# EAGLE schematic board(diff - locked for some reason) (EAGLE 8.3.1)
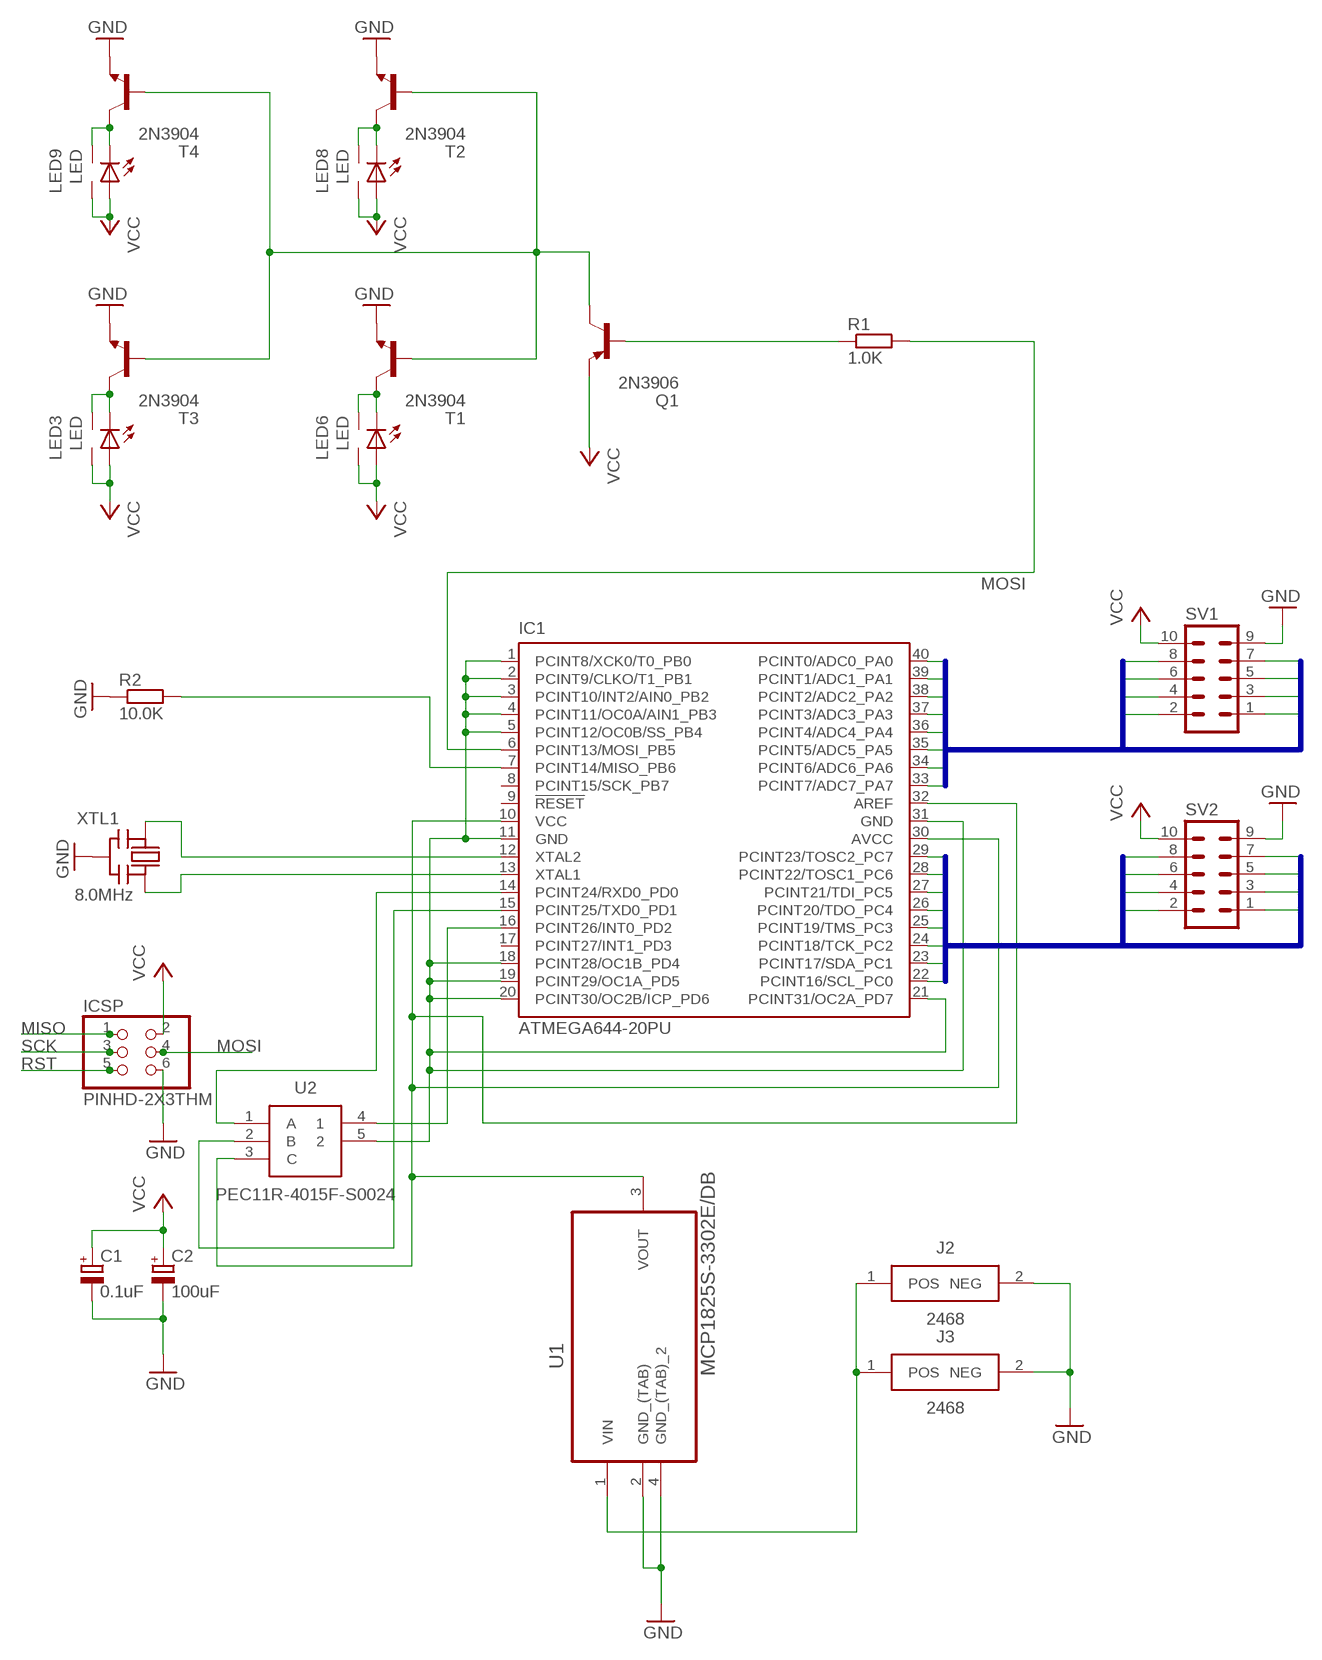
[diagram p0: schematic, sheet 1]

## Parts
C1  0.1uF  CPOL-EUE2,5-6E  [E2,5-6E]
C2  100uF  CPOL-EUE2,5-6E  [E2,5-6E]
IC1  ATMEGA644-20PU  [DIL40]
ICSP  PINHD-2X3THM  [ISP6]
J2  2468  [2468]
J3  2468  [2468]
LED3  LED  [5MM-SIDE]
LED6  LED  [5MM-SIDE]
LED8  LED  [5MM-SIDE]
LED9  LED  [5MM-SIDE]
Q1  2N3906  [TO92]
R1  1.0K  R-EU_0207/7  [0207/7]
R2  10.0K  R-EU_0207/7  [0207/7]
SV1  MA05-2  [MA05-2]
SV2  MA05-2  [MA05-2]
T1  2N3904  [TO92]
T2  2N3904  [TO92]
T3  2N3904  [TO92]
T4  2N3904  [TO92]
U1  MCP1825S-3302E/DB  [SOT230P700X180-4N]
U2  PEC11R-4015F-S0024  [PEC12R-4XXXF-SXXXX_1]
XTL1  8.0MHz  CERMOSCILL  [CERM_OSC]

## Nets
GND: C1.- C2.- ICSP.6 J2.2(NEG) J3.2(NEG) R2.1 SV1.9 SV2.9 T1.3(E) T2.3(E) T3.3(E) T4.3(E) U1.2(GND_(TAB)) U1.4(GND_(TAB)_2) XTL1.P$2(GND)
MISO: ICSP.1
MOSI: IC1.6(PCINT13/MOSI_PB5) ICSP.4 R1.2
N$1: LED6.K2(C1) LED6.K(C) T1.1(C)
N$2: LED3.K2(C1) LED3.K(C) T3.1(C)
N$3: LED8.K2(C1) LED8.K(C) T2.1(C)
N$4: LED9.K2(C1) LED9.K(C) T4.1(C)
N$5: Q1.1(C) T1.2(B) T2.2(B) T3.2(B) T4.2(B)
N$6: IC1.14(PCINT24/RXD0_PD0) U2.1(A)
N$7: IC1.15(PCINT25/TXD0_PD1) U2.2(B)
N$8: IC1.10(VCC) IC1.30(AVCC) IC1.32(AREF) U1.3(VOUT) U2.3(C)
N$9: IC1.12(XTAL2) XTL1.P$1(IN)
N$10: IC1.13(XTAL1) XTL1.P$3(OUT)
N$11: IC1.7(PCINT14/MISO_PB6) R2.2
N$13: IC1.16(PCINT26/INT0_PD2) U2.4
N$16: J2.1(POS) J3.1(POS) U1.1(VIN)
N$21: IC1.1(PCINT8/XCK0/T0_PB0) IC1.2(PCINT9/CLKO/T1_PB1) IC1.3(PCINT10/INT2/AIN0_PB2) IC1.4(PCINT11/OC0A/AIN1_PB3) IC1.5(PCINT12/OC0B/SS_PB4) IC1.11(GND) IC1.18(PCINT28/OC1B_PD4) IC1.19(PCINT29/OC1A_PD5) IC1.20(PCINT30/OC2B/ICP_PD6) IC1.21(PCINT31/OC2A_PD7) IC1.31(GND) U2.5
N$22: Q1.2(B) R1.1
PA0: IC1.40(PCINT0/ADC0_PA0) SV1.8
PA1: IC1.39(PCINT1/ADC1_PA1) SV1.6
PA2: IC1.38(PCINT2/ADC2_PA2) SV1.4
PA3: IC1.37(PCINT3/ADC3_PA3) SV1.2
PA4: IC1.36(PCINT4/ADC4_PA4) SV1.1
PA5: IC1.35(PCINT5/ADC5_PA5) SV1.3
PA6: IC1.34(PCINT6/ADC6_PA6) SV1.5
PA7: IC1.33(PCINT7/ADC7_PA7) SV1.7
PC0: IC1.22(PCINT16/SCL_PC0) SV2.8
PC1: IC1.23(PCINT17/SDA_PC1) SV2.6
PC2: IC1.24(PCINT18/TCK_PC2) SV2.4
PC3: IC1.25(PCINT19/TMS_PC3) SV2.2
PC4: IC1.26(PCINT20/TDO_PC4) SV2.1
PC5: IC1.27(PCINT21/TDI_PC5) SV2.3
PC6: IC1.28(PCINT22/TOSC1_PC6) SV2.5
PC7: IC1.29(PCINT23/TOSC2_PC7) SV2.7
RST: ICSP.5
SCK: ICSP.3
VCC: C1.+ C2.+ ICSP.2 LED3.A LED3.A2(A1) LED6.A LED6.A2(A1) LED8.A LED8.A2(A1) LED9.A LED9.A2(A1) Q1.3(E) SV1.10 SV2.10
Unconnected: IC1.8(PCINT15/SCK_PB7) IC1.9(!RESET) IC1.17(PCINT27/INT1_PD3)

## Buses
PA[0..7]
PC[0..7]

## Library data of the parts
C1 C2 = rcl:CPOL-EU: POLARIZED CAPACITOR, European symbol
IC1 = atmel:ATMEGA644-*PU: 8-bit Microcontroller with 64K Bytes In-System Programmable Flash Auto generated by make-symbol-device-package-bsdl.ulp Rev. 34 Source: http://www.atmel.com/dyn/resources/prod_documents/doc2593.pdf; MPN: ATMEGA644-20PU; OC_FARNELL: 1288340; OC_NEWARK: 23M5060
ICSP = adaprog:PINHD-2X3
J2 J3 = SamacSys_Parts:2468: Cylindrical Battery Contacts, Clips, Holders & Springs 2AAA PC MNT HOLDER <https://componentsearchengine.com/Images/1/2468.jpg> Source: Datasheet <http://docs-europe.electrocomponents.com/webdocs/002e/0900766b8002ef75.pdf>; ALLIED_NUMBER: 70182756; DESCRIPTION: Cylindrical Battery Contacts, Clips, Holders & Springs 2AAA PC MNT HOLDER; HEIGHT: mm; MANUFACTURER_NAME: Keystone Electronics; MANUFACTURER_PART_NUMBER: 2468; RS_PART_NUMBER: 2794965; SUPPLIER_NAME: RS
LED3 LED6 LED8 LED9 = tvbgone:LED
Q1 = transistor-pnp:2N3906: PNP Transistor
R1 R2 = resistor:R-EU_: RESISTOR, European symbol
SV1 SV2 = con-lstb:MA05-2: PIN HEADER; OC_FARNELL: unknown; OC_NEWARK: unknown
T1-T4 = transistor:2N3904: NPN TRANSISTOR
U1 = MCP1825S-3302E_DB:MCP1825S-3302E/DB: IC, LDO VOLT REG, 3.3V, 0.5A; AVAILABILITY: Good; DESCRIPTION: MCP1825 Series 500 mA Low Quiescent Current LDO Regulator - SOT-223-3; MF: Microchip; MP: MCP1825S-3302E/DB; PACKAGE: SOT-223-3 Microchip; PRICE: 0.46 USD
U2 = SamacSys_Parts:PEC11R-4015F-S0024: Bourns 24 Pulse Incremental Mechanical Rotary Encoder with a 6 mm Flat Shaft (Not Indexed), Through Hole <https://componentsearchengine.com/Images/3/PEC11R-4015F-S0024.jpg> Source: Datasheet <https://www.bourns.com/docs/Product-Datasheets/pec11R.pdf>; DESCRIPTION: Bourns 24 Pulse Incremental Mechanical Rotary Encoder with a 6 mm Flat Shaft (Not Indexed), Through Hole; HEIGHT: mm; MANUFACTURER_NAME: Bourns; MANUFACTURER_PART_NUMBER: PEC11R-4015F-S0024; RS_PART_NUMBER: 7377739P; SUPPLIER_NAME: RS
XTL1 = digg:CERMOSCILL